# Altium project CCZynq.PrjPCB (part 1 of 4)
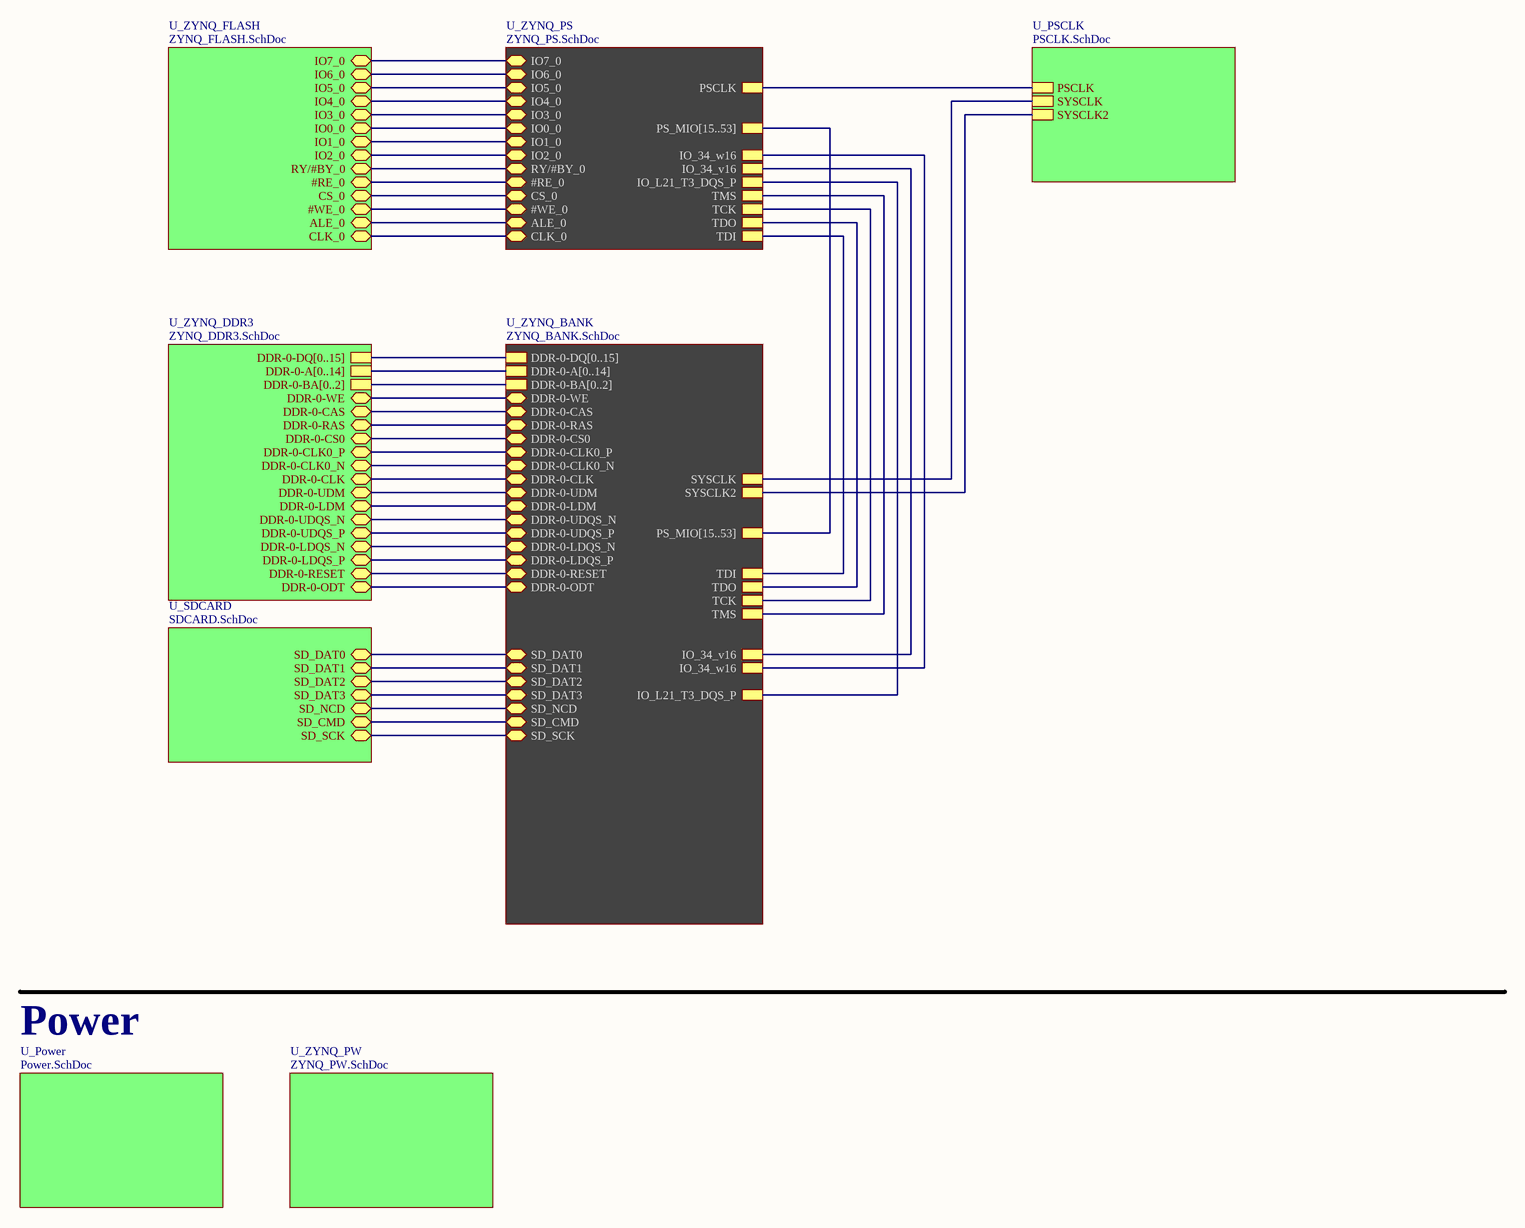
[diagram p0: Diagram.SchDoc]
10 sheets, 213 parts. Net scope: hierarchical (ports join the sheet entries above them; power ports are global).
Board file: DDR3.PcbDoc
Sheets:
  Diagram.SchDoc
    U_ZYNQ_PS = ZYNQ_PS.SchDoc
    U_ZYNQ_BANK = ZYNQ_BANK.SchDoc
    U_ZYNQ_FLASH = ZYNQ_FLASH.SchDoc
    U_ZYNQ_DDR3 = ZYNQ_DDR3.SchDoc
    U_ZYNQ_PW = ZYNQ_PW.SchDoc
    U_Power = Power.SchDoc
      U_Power_DDRTermination = Power_DDRTermination.SchDoc
    U_SDCARD = SDCARD.SchDoc
    U_PSCLK = PSCLK.SchDoc

## Sheet Diagram.SchDoc
size 431 x 279 mm

### Sub-sheets
U_Power = Power.SchDoc: no entries
U_PSCLK = PSCLK.SchDoc: PSCLK, SYSCLK, SYSCLK2
U_SDCARD = SDCARD.SchDoc: SD_DAT0 (bidir), SD_DAT1 (bidir), SD_DAT2 (bidir), SD_DAT3 (bidir), SD_NCD (bidir), SD_CMD (bidir), SD_SCK (bidir)
U_ZYNQ_BANK = ZYNQ_BANK.SchDoc: DDR-0-DQ[0..15], DDR-0-A[0..14], DDR-0-BA[0..2], DDR-0-WE (bidir), DDR-0-CAS (bidir), DDR-0-RAS (bidir), DDR-0-CS0 (bidir), DDR-0-CLK0_P (bidir), DDR-0-CLK0_N (bidir), DDR-0-CLK (bidir), DDR-0-UDM (bidir), DDR-0-LDM (bidir), DDR-0-UDQS_N (bidir), DDR-0-UDQS_P (bidir), DDR-0-LDQS_N (bidir), DDR-0-LDQS_P (bidir), DDR-0-RESET (bidir), DDR-0-ODT (bidir), SD_CMD (bidir), SD_DAT0 (bidir), SD_SCK (bidir), SD_DAT1 (bidir), SD_DAT2 (bidir), SD_DAT3 (bidir), SD_NCD (bidir), SYSCLK, SYSCLK2, PS_MIO[15..53], TDI, TDO, TCK, TMS, IO_34_v16, IO_34_w16, IO_L21_T3_DQS_P
U_ZYNQ_DDR3 = ZYNQ_DDR3.SchDoc: DDR-0-DQ[0..15], DDR-0-A[0..14], DDR-0-BA[0..2], DDR-0-WE (bidir), DDR-0-CAS (bidir), DDR-0-RAS (bidir), DDR-0-CS0 (bidir), DDR-0-CLK0_P (bidir), DDR-0-CLK0_N (bidir), DDR-0-CLK (bidir), DDR-0-UDM (bidir), DDR-0-LDM (bidir), DDR-0-UDQS_N (bidir), DDR-0-UDQS_P (bidir), DDR-0-LDQS_N (bidir), DDR-0-LDQS_P (bidir), DDR-0-RESET (bidir), DDR-0-ODT (bidir)
U_ZYNQ_FLASH = ZYNQ_FLASH.SchDoc: IO7_0 (bidir), IO6_0 (bidir), IO5_0 (bidir), IO4_0 (bidir), IO3_0 (bidir), IO0_0 (bidir), IO1_0 (bidir), IO2_0 (bidir), RY/#BY_0 (bidir), #RE_0 (bidir), CS_0 (bidir), #WE_0 (bidir), ALE_0 (bidir), CLK_0 (bidir)
U_ZYNQ_PS = ZYNQ_PS.SchDoc: IO7_0 (bidir), IO6_0 (bidir), IO5_0 (bidir), IO4_0 (bidir), IO3_0 (bidir), IO0_0 (bidir), IO1_0 (bidir), IO2_0 (bidir), RY/#BY_0 (bidir), #RE_0 (bidir), CS_0 (bidir), #WE_0 (bidir), ALE_0 (bidir), CLK_0 (bidir), PSCLK, PS_MIO[15..53], TDI, TDO, TCK, TMS, IO_34_v16, IO_34_w16, IO_L21_T3_DQS_P
U_ZYNQ_PW = ZYNQ_PW.SchDoc: no entries

### Nets
#RE_0: sheet U_ZYNQ_PS/#RE_0, sheet U_ZYNQ_FLASH/#RE_0
#WE_0: sheet U_ZYNQ_PS/#WE_0, sheet U_ZYNQ_FLASH/#WE_0
ALE_0: sheet U_ZYNQ_PS/ALE_0, sheet U_ZYNQ_FLASH/ALE_0
CLK_0: sheet U_ZYNQ_PS/CLK_0, sheet U_ZYNQ_FLASH/CLK_0
CS_0: sheet U_ZYNQ_PS/CS_0, sheet U_ZYNQ_FLASH/CS_0
DDR-0-CAS: sheet U_ZYNQ_BANK/DDR-0-CAS, sheet U_ZYNQ_DDR3/DDR-0-CAS
DDR-0-CLK: sheet U_ZYNQ_BANK/DDR-0-CLK, sheet U_ZYNQ_DDR3/DDR-0-CLK
DDR-0-CLK0_N: sheet U_ZYNQ_BANK/DDR-0-CLK0_N, sheet U_ZYNQ_DDR3/DDR-0-CLK0_N
DDR-0-CLK0_P: sheet U_ZYNQ_BANK/DDR-0-CLK0_P, sheet U_ZYNQ_DDR3/DDR-0-CLK0_P
DDR-0-CS0: sheet U_ZYNQ_BANK/DDR-0-CS0, sheet U_ZYNQ_DDR3/DDR-0-CS0
DDR-0-LDM: sheet U_ZYNQ_BANK/DDR-0-LDM, sheet U_ZYNQ_DDR3/DDR-0-LDM
DDR-0-LDQS_N: sheet U_ZYNQ_BANK/DDR-0-LDQS_N, sheet U_ZYNQ_DDR3/DDR-0-LDQS_N
DDR-0-LDQS_P: sheet U_ZYNQ_BANK/DDR-0-LDQS_P, sheet U_ZYNQ_DDR3/DDR-0-LDQS_P
DDR-0-ODT: sheet U_ZYNQ_BANK/DDR-0-ODT, sheet U_ZYNQ_DDR3/DDR-0-ODT
DDR-0-RAS: sheet U_ZYNQ_BANK/DDR-0-RAS, sheet U_ZYNQ_DDR3/DDR-0-RAS
DDR-0-RESET: sheet U_ZYNQ_BANK/DDR-0-RESET, sheet U_ZYNQ_DDR3/DDR-0-RESET
DDR-0-UDM: sheet U_ZYNQ_BANK/DDR-0-UDM, sheet U_ZYNQ_DDR3/DDR-0-UDM
DDR-0-UDQS_N: sheet U_ZYNQ_BANK/DDR-0-UDQS_N, sheet U_ZYNQ_DDR3/DDR-0-UDQS_N
DDR-0-UDQS_P: sheet U_ZYNQ_BANK/DDR-0-UDQS_P, sheet U_ZYNQ_DDR3/DDR-0-UDQS_P
DDR-0-WE: sheet U_ZYNQ_BANK/DDR-0-WE, sheet U_ZYNQ_DDR3/DDR-0-WE
IO0_0: sheet U_ZYNQ_PS/IO0_0, sheet U_ZYNQ_FLASH/IO0_0
IO1_0: sheet U_ZYNQ_PS/IO1_0, sheet U_ZYNQ_FLASH/IO1_0
IO2_0: sheet U_ZYNQ_PS/IO2_0, sheet U_ZYNQ_FLASH/IO2_0
IO3_0: sheet U_ZYNQ_PS/IO3_0, sheet U_ZYNQ_FLASH/IO3_0
IO4_0: sheet U_ZYNQ_PS/IO4_0, sheet U_ZYNQ_FLASH/IO4_0
IO5_0: sheet U_ZYNQ_PS/IO5_0, sheet U_ZYNQ_FLASH/IO5_0
IO6_0: sheet U_ZYNQ_PS/IO6_0, sheet U_ZYNQ_FLASH/IO6_0
IO7_0: sheet U_ZYNQ_PS/IO7_0, sheet U_ZYNQ_FLASH/IO7_0
IO_34_v16: sheet U_ZYNQ_PS/IO_34_v16, sheet U_ZYNQ_BANK/IO_34_v16
IO_34_w16: sheet U_ZYNQ_PS/IO_34_w16, sheet U_ZYNQ_BANK/IO_34_w16
IO_L21_T3_DQS_P: sheet U_ZYNQ_PS/IO_L21_T3_DQS_P, sheet U_ZYNQ_BANK/IO_L21_T3_DQS_P
PSCLK: sheet U_ZYNQ_PS/PSCLK, sheet U_PSCLK/PSCLK
RY/#BY_0: sheet U_ZYNQ_PS/RY/#BY_0, sheet U_ZYNQ_FLASH/RY/#BY_0
SD_CMD: sheet U_ZYNQ_BANK/SD_CMD, sheet U_SDCARD/SD_CMD
SD_DAT0: sheet U_ZYNQ_BANK/SD_DAT0, sheet U_SDCARD/SD_DAT0
SD_DAT1: sheet U_ZYNQ_BANK/SD_DAT1, sheet U_SDCARD/SD_DAT1
SD_DAT2: sheet U_ZYNQ_BANK/SD_DAT2, sheet U_SDCARD/SD_DAT2
SD_DAT3: sheet U_ZYNQ_BANK/SD_DAT3, sheet U_SDCARD/SD_DAT3
SD_NCD: sheet U_ZYNQ_BANK/SD_NCD, sheet U_SDCARD/SD_NCD
SD_SCK: sheet U_ZYNQ_BANK/SD_SCK, sheet U_SDCARD/SD_SCK
SYSCLK: sheet U_ZYNQ_BANK/SYSCLK, sheet U_PSCLK/SYSCLK
SYSCLK2: sheet U_ZYNQ_BANK/SYSCLK2, sheet U_PSCLK/SYSCLK2
TCK: sheet U_ZYNQ_PS/TCK, sheet U_ZYNQ_BANK/TCK
TDI: sheet U_ZYNQ_PS/TDI, sheet U_ZYNQ_BANK/TDI
TDO: sheet U_ZYNQ_PS/TDO, sheet U_ZYNQ_BANK/TDO
TMS: sheet U_ZYNQ_PS/TMS, sheet U_ZYNQ_BANK/TMS

### Buses and harness runs
bus sheet U_ZYNQ_BANK/DDR-0-A[0..14] = sheet U_ZYNQ_DDR3/DDR-0-A[0..14]
bus sheet U_ZYNQ_BANK/DDR-0-BA[0..2] = sheet U_ZYNQ_DDR3/DDR-0-BA[0..2]
bus sheet U_ZYNQ_BANK/DDR-0-DQ[0..15] = sheet U_ZYNQ_DDR3/DDR-0-DQ[0..15]
bus sheet U_ZYNQ_BANK/PS_MIO[15..53] = sheet U_ZYNQ_PS/PS_MIO[15..53]

### Notes on the sheet
- Power
- DWG. NO.
- REV.
- SHT.
- THIS DOCUMENT AND THE DATA DISCLOSED HEREIN OR HEREWITH IS THE PROPERTY OF ALTIUM LIMITED AND MAY BE FREELY DISTRIBUTED IN WHOLE. NO RIGHTS ARE RESERVED OR EXPRESS OR IMPLIED WARANTEE GIVEN.
- REVISION
- DESCRIPTION
- DATE
- APPROVED
- ENG:
- APPROVALS
- PROJECT
- DSN:
- CHK:
- REFERENCE DOCUMENTS
- PROJECT REVISION:
- TITLE
- DOCUMENT REVISION:
- DESIGN ITEM:
- BOM:
- FAB DWG:
- PCB DWG:
- ASSY DWG:
- SCALE:
- SIZE
- B
- CAGE CODE
- FILE NAME
- DWG NO.
- SHEET
- OF
- REV

## Sheet ZYNQ_PS.SchDoc
size 431 x 279 mm
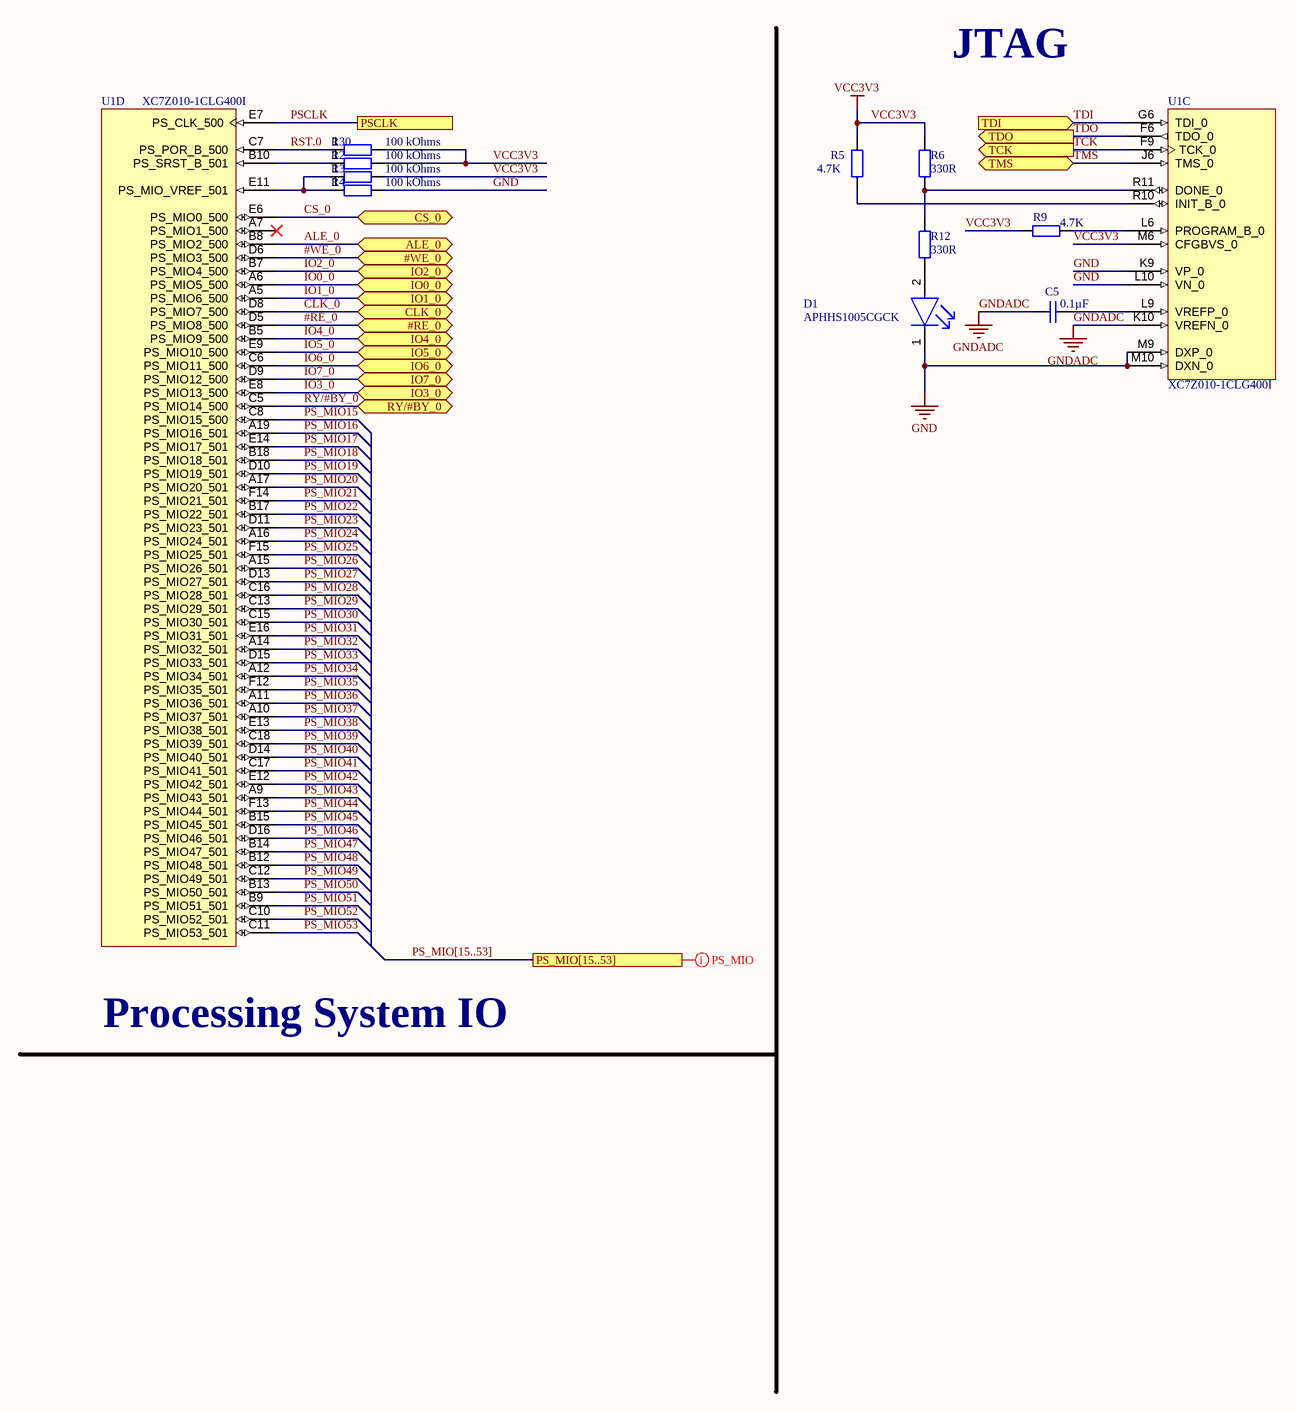
[diagram p1: ZYNQ_PS.SchDoc]

### Parts
C5  0.1µF  [CAP0402i]
D1  APHHS1005CGCK  [FP-APHHS1005CGCK-MFG]
R2  100 kOhms  [RES0402i]
R3  100 kOhms  [RES0402i]
R4  100 kOhms  [RES0402i]
R5  4.7K  [RES0402i]
R6  330R  [RES0402i]
R9  4.7K  [RES0402i]
R12  330R  [RES0402i]
R30  100 kOhms  [RES0402i]
U1  XC7Z010-1CLG400I  [CLG400]  (parts C,D of 9)

### Ports
#RE_0 (bidir), #WE_0 (bidir), ALE_0 (bidir), CLK_0 (bidir), CS_0 (bidir), IO0_0 (bidir), IO1_0 (bidir), IO2_0 (bidir), IO3_0 (bidir), IO4_0 (bidir), IO5_0 (bidir), IO6_0 (bidir), IO7_0 (bidir), PS_MIO[15..53], PSCLK, RY/#BY_0 (bidir), TCK (out), TDI (in), TDO (out), TMS (bidir)

### Nets
GND: D1.1(C) R4.2 U1.K9(VP_0) U1.L10(VN_0) U1.M9(DXP_0) U1.M10(DXN_0)
GNDADC: C5.1 U1.K10(VREFN_0)
VCC3V3: R2.2 R3.2 R5.2 R6.1 R9.1 R30.2 U1.M6(CFGBVS_0)
#RE_0: U1.D5(PS_MIO8_500) ; port #RE_0
#WE_0: U1.D6(PS_MIO3_500) ; port #WE_0
ALE_0: U1.B8(PS_MIO2_500) ; port ALE_0
CLK_0: U1.D8(PS_MIO7_500) ; port CLK_0
CS_0: U1.E6(PS_MIO0_500) ; port CS_0
IO0_0: U1.A6(PS_MIO5_500) ; port IO0_0
IO1_0: U1.A5(PS_MIO6_500) ; port IO1_0
IO2_0: U1.B7(PS_MIO4_500) ; port IO2_0
IO3_0: U1.E8(PS_MIO13_500) ; port IO3_0
IO4_0: U1.B5(PS_MIO9_500) ; port IO4_0
IO5_0: U1.E9(PS_MIO10_500) ; port IO5_0
IO6_0: U1.C6(PS_MIO11_500) ; port IO6_0
IO7_0: U1.D9(PS_MIO12_500) ; port IO7_0
PS_MIO15: U1.C8(PS_MIO15_500)
PS_MIO16: U1.A19(PS_MIO16_501)
PS_MIO17: U1.E14(PS_MIO17_501)
PS_MIO18: U1.B18(PS_MIO18_501)
PS_MIO19: U1.D10(PS_MIO19_501)
PS_MIO20: U1.A17(PS_MIO20_501)
PS_MIO21: U1.F14(PS_MIO21_501)
PS_MIO22: U1.B17(PS_MIO22_501)
PS_MIO23: U1.D11(PS_MIO23_501)
PS_MIO24: U1.A16(PS_MIO24_501)
PS_MIO25: U1.F15(PS_MIO25_501)
PS_MIO26: U1.A15(PS_MIO26_501)
PS_MIO27: U1.D13(PS_MIO27_501)
PS_MIO28: U1.C16(PS_MIO28_501)
PS_MIO29: U1.C13(PS_MIO29_501)
PS_MIO30: U1.C15(PS_MIO30_501)
PS_MIO31: U1.E16(PS_MIO31_501)
PS_MIO32: U1.A14(PS_MIO32_501)
PS_MIO33: U1.D15(PS_MIO33_501)
PS_MIO34: U1.A12(PS_MIO34_501)
PS_MIO35: U1.F12(PS_MIO35_501)
PS_MIO36: U1.A11(PS_MIO36_501)
PS_MIO37: U1.A10(PS_MIO37_501)
PS_MIO38: U1.E13(PS_MIO38_501)
PS_MIO39: U1.C18(PS_MIO39_501)
PS_MIO40: U1.D14(PS_MIO40_501)
PS_MIO41: U1.C17(PS_MIO41_501)
PS_MIO42: U1.E12(PS_MIO42_501)
PS_MIO43: U1.A9(PS_MIO43_501)
PS_MIO44: U1.F13(PS_MIO44_501)
PS_MIO45: U1.B15(PS_MIO45_501)
PS_MIO46: U1.D16(PS_MIO46_501)
PS_MIO47: U1.B14(PS_MIO47_501)
PS_MIO48: U1.B12(PS_MIO48_501)
PS_MIO49: U1.C12(PS_MIO49_501)
PS_MIO50: U1.B13(PS_MIO50_501)
PS_MIO51: U1.B9(PS_MIO51_501)
PS_MIO52: U1.C10(PS_MIO52_501)
PS_MIO53: U1.C11(PS_MIO53_501)
PSCLK: U1.E7(PS_CLK_500) ; port PSCLK
RST.0: R30.1 U1.C7(PS_POR_B_500)
RY/#BY_0: U1.C5(PS_MIO14_500) ; port RY/#BY_0
TCK: U1.F9(TCK_0) ; port TCK
TDI: U1.G6(TDI_0) ; port TDI
TDO: U1.F6(TDO_0) ; port TDO
TMS: U1.J6(TMS_0) ; port TMS
NetC5_2: C5.2 U1.L9(VREFP_0)
NetD1_2: D1.2(A) R12.1
NetR2_1: R2.1 U1.B10(PS_SRST_B_501)
NetR3_1: R3.1 R4.1 U1.E11(PS_MIO_VREF_501)
NetR5_1: R5.1 U1.R10(INIT_B_0)
NetR6_2: R6.2 R12.2 U1.R11(DONE_0)
NetR9_2: R9.2 U1.L6(PROGRAM_B_0)

Not connected (* = marked no-connect by the designer): U1 A7(PS_MIO1_500)*

### Buses and harness runs
bus PS_MIO[15..53] = port PS_MIO[15..53]

### Layout directives
net class PS_MIO; rule Width Constraint [Pref Width = 0.1mm    Min Width = 0.08mm    Max Width = 0.2mm]: (no net found under the mark)

### Notes on the sheet
- JTAG
- Processing System IO
- DWG. NO.
- REV.
- SHT.
- THIS DOCUMENT AND THE DATA DISCLOSED HEREIN OR HEREWITH IS THE PROPERTY OF ALTIUM LIMITED AND MAY BE FREELY DISTRIBUTED IN WHOLE. NO RIGHTS ARE RESERVED OR EXPRESS OR IMPLIED WARANTEE GIVEN.
- REVISION
- DESCRIPTION
- DATE
- APPROVED
- ENG:
- APPROVALS
- PROJECT
- DSN:
- CHK:
- REFERENCE DOCUMENTS
- PROJECT REVISION:
- TITLE
- DOCUMENT REVISION:
- DESIGN ITEM:
- BOM:
- FAB DWG:
- PCB DWG:
- ASSY DWG:
- SCALE:
- SIZE
- B
- CAGE CODE
- FILE NAME
- DWG NO.
- SHEET
- OF
- REV

### Library data of the parts
C5 = Cap_0.1uF_50V_X7R_0402: 0402, 0.1uF, 10%,  50V, X7R; Manufacturer 1: TDK; Manufacturer Part Number 1: C1005X7R1H104K050BE; Type: Ceramic; Value: 0.1µF,50V,X7R; Package: 0402 (1005 Metric); Applications: Automotive; Capacitance: 0.1µF; Component Type: Generic; Mounting Type: SMT; Operating Temperature: -55°C ~ 125°C; Part Number: C1005X7R1H104K050BE; Ratings: AEC-Q200; Supplier 1: Mouser; Supplier 2: DigiKey; Supplier 3: Farnell; Supplier Part Number 1: 810-C1005X7R1H104KBE; Supplier Part Number 2: 445-173610-1-ND; Supplier Part Number 3: 3416071; Temperature Coefficient: X7R; Tolerance: ±10%; Voltage: 50V
D1 = CMP-44529-000044-1: LED GREEN CLEAR CHIP SMD; Viewing Angle: 120°; Dominant Wavelength: 570nm; Test Current: 20mA; Luminous Intensity: 50mcd; Forward Voltage: 2.1V; Number of LEDs: 1; Lens Color: Clear; Packaging: Tape and Reel; Max Operating Temperature: 85°C; Illumination Color: Green; Length: 1mm; Mount: Surface Mount; Lens Style: Clear; Color: Green; Number of Pins: 2; Wavelength: 570nm; Case/Package: 0402; Width: 0.5mm; Package Quantity: 2000; Case Code (Metric): 1005; Height: 0.6mm; Lead Free: Lead Free; Case Code (Imperial): 0402; Forward Current: 20mA; Min Operating Temperature: -40°C
R2-R4 R30 = Res_100K_1%_0402: 0402, 100k, 1%, 62.5mW, 50V; Part Number: CR0402-FX-1003GLF; Manufacturer 1: Bourns; Temperature Coefficient: 100 PPM / C; Package: 0402 (1005 Metric); Voltage: 50 V; Tolerance: ±1%; Operating Temperature: -55°C ~ 125°C; Mounting Type: SMT; Supplier 1: Mouser; Supplier Part Number 1: 652-CR0402FX-1003GLF; Manufacturer Part Number 1: CR0402-FX-1003GLF; Component Type: Generic; Resistance: 100 kOhms; Note: *; Supplier 2: DigiKey; Supplier 3: Farnell; Supplier Part Number 2: CR0402-FX-1003GLFCT-ND; Supplier Part Number 3: 2787798; Value: 100k,1%,62.5mW,50V
R5 R9 = Res_4K7_1%_0402: 0402,4.7K,1%,63mW,50V; Part Number: AC0402FR-074K7L; Manufacturer 1: YAGEO; Alternative Part Number: CR0402-FX-4701GLF; Temperature Coefficient: 100 PPM / C; Value: 4K7,1%,63mW,50V; Package: 0402 (1005 Metric); Voltage: 50V; Tolerance: ±1%; Operating Temperature: -55°C ~ 125°C; Component Type: Generic; Resistance: 4.7K; Note: *; Manufacturer 2: Bourns; Manufacturer Part Number 2: CR0402-FX-4701GLF; Mounting Type: SMT; Manufacturer Part Number 1: AC0402FR-074K7L; Supplier 1: Mouser; Supplier 2: Digi-Key; Supplier 3: Farnell; Supplier 4: Mouser; Supplier 5: Digi-Key; Supplier 6: Farnell; Supplier Part Number 1: 603-AC0402FR-074K7L; Supplier Part Number 2: YAG3497CT-ND; Supplier Part Number 3: 3495205; Supplier Part Number 4: 652-CR0402FX-4701GLF; Supplier Part Number 6: 4014423; Supplier Part Number 5: CR0402-FX-4701GLFCT-ND
R6 R12 = Res_330R_1%_50V_0402: Res Thick Film 0402 330 Ohm 1% 1/16W ±100ppm/°C Molded SMD Paper T/R; Part Number: CRCW0402330RFKED; Manufacturer 1: Vishay; Voltage: 50; Power Rating: 63mW; Voltage Rating: 50V; Value: 330R,1%,1/10W,50V; ComponentLink1Description: https://datasheet.ciiva.com/11821/0900766b80f80784-11821294.pdf?src-supplier=RSComponents; ComponentLink1URL: https://datasheet.ciiva.com/11821/0900766b80f80784-11821294.pdf?src-supplier=RSComponents; Manufacturer Part Number 1: CRCW0402330RFKED; Component Type: Generic; Resistance: 330R; Note: *; ComponentLink2URL: https://datasheet.ciiva.com/7802/aoa0000ce2-7802409.pdf?src-supplier=Element14; ComponentLink2Description: https://datasheet.ciiva.com/7802/aoa0000ce2-7802409.pdf?src-supplier=Element14; ComponentLink3URL: https://datasheet.ciiva.com/22673/1678782-22673685.pdf?src-supplier=Element14; ComponentLink3Description: https://datasheet.ciiva.com/22673/1678782-22673685.pdf?src-supplier=Element14; ComponentLink4URL: https://datasheet.ciiva.com/22687/1678782-22687071.pdf?src-supplier=Element14; ComponentLink4Description: https://datasheet.ciiva.com/22687/1678782-22687071.pdf?src-supplier=Element14; ComponentLink5URL: https://datasheet.ciiva.com/22737/426256-22737285.pdf?src-supplier=Element14; ComponentLink5Description: https://datasheet.ciiva.com/22737/426256-22737285.pdf?src-supplier=Element14; ComponentLink6URL: https://datasheet.ciiva.com/46420/1678782-46420317.pdf?src-supplier=Element14; ComponentLink6Description: https://datasheet.ciiva.com/46420/1678782-46420317.pdf?src-supplier=Element14; ComponentLink7URL: https://datasheet.ciiva.com/24024/aoa0000ce2-24024398.pdf?src-supplier=Mouser; ComponentLink7Description: https://datasheet.ciiva.com/24024/aoa0000ce2-24024398.pdf?src-supplier=Mouser; ComponentLink8URL: https://datasheet.ciiva.com/16784/70260748-16784773.pdf?src-supplier=Allied+Electronics; ComponentLink8Description: https://datasheet.ciiva.com/16784/70260748-16784773.pdf?src-supplier=Allied+Electronics; ComponentLink9URL: https://datasheet.ciiva.com/9190/aoa0000ce2-9190679.pdf?src-supplier=Avnet; ComponentLink9Description: https://datasheet.ciiva.com/9190/aoa0000ce2-9190679.pdf?src-supplier=Avnet; ComponentLink10URL: https://datasheet.ciiva.com/30159/aoa0000ce2-30159014.pdf?src-supplier=Onlinecomponents.com; ComponentLink10Description: https://datasheet.ciiva.com/30159/aoa0000ce2-30159014.pdf?src-supplier=Onlinecomponents.com; Supplier 1: Mouser; Manufacturer: Vishay; Manufacturer Part Number: CRCW0402330RFKED; RoHS: Yes; Category: Chip SMD Resistors; Stock 1: 25067; Pricing 1: 1=0.1, 10=0.042, 50=0.042, 100=0.017, 1000=0.008, 10000=0.005 (USD); Case/Package: 0402; Case Code (Imperial): 0402; Case Code (Metric): 1005; Contact Plating: Tin; Weight: 2.3E-05oz; Min Operating Temperature: -55°C; Max Operating Temperature: 155°C; Packaging: Tape and Reel; Temperature Coefficient: 100ppm/°C; Series: CRCW; Tolerance: 1%; Number of Terminations: 2; Max Power Dissipation: 63mW; Resistor Type: Thick Film; Features: Automotive AEC-Q200; Resistance Tolerance: 1%; Package Quantity: 10; Termination: SMD/SMT; Voltage Rating (DC): 50V; Construction: Rectangular; Technology: THICK FILM; Length: 1mm; Width: 0.02inch; Height: 0.35mm; Depth: 0.5mm; Radiation Hardening: No; RoHS Compliant: Yes; Reach SVHC Compliant: Unknown; Lead Free: Lead Free; Military Standard: Not; ComponentLink11URL: https://datasheet.ciiva.com/11811/0900766b80d98824-11811100.pdf?src-supplier=Rs; ComponentLink11Description: https://datasheet.ciiva.com/11811/0900766b80d98824-11811100.pdf?src-supplier=Rs; ComponentLink12URL: https://datasheet.ciiva.com/7777/1697337-7777541.pdf?src-supplier=Element14; ComponentLink12Description: https://datasheet.ciiva.com/7777/1697337-7777541.pdf?src-supplier=Element14; ComponentLink13URL: https://datasheet.ciiva.com/7777/1697337-7777542.pdf?src-supplier=Element14; ComponentLink13Description: https://datasheet.ciiva.com/7777/1697337-7777542.pdf?src-supplier=Element14; ComponentLink14URL: https://datasheet.ciiva.com/2463/dcrcwe3-2463479.pdf?src-supplier=Digi-Key; ComponentLink14Description: https://datasheet.ciiva.com/2463/dcrcwe3-2463479.pdf?src-supplier=Digi-Key; ComponentLink15URL: https://datasheet.ciiva.com/2463/dcrcwe3-2463480.pdf?src-supplier=Digi-Key; ComponentLink15Description: https://datasheet.ciiva.com/2463/dcrcwe3-2463480.pdf?src-supplier=Digi-Key; ComponentLink16URL: https://datasheet.ciiva.com/2463/dcrcwe3-2463478.pdf?src-supplier=Digi-Key; ComponentLink16Description: https://datasheet.ciiva.com/2463/dcrcwe3-2463478.pdf?src-supplier=Digi-Key; ComponentLink17URL: https://datasheet.ciiva.com/16772/70201119-16772762.pdf?src-supplier=Allied+Electronics; ComponentLink17Description: https://datasheet.ciiva.com/16772/70201119-16772762.pdf?src-supplier=Allied+Electronics; ComponentLink18URL: https://datasheet.ciiva.com/5549/dcrcwe3-109170-5549013.pdf?src-supplier=Mouser; ComponentLink18Description: https://datasheet.ciiva.com/5549/dcrcwe3-109170-5549013.pdf?src-supplier=Mouser; ComponentLink19URL: https://datasheet.ciiva.com/16429/dcrcwe3-16429993.pdf?src-supplier=Future+Electronics; ComponentLink19Description: https://datasheet.ciiva.com/16429/dcrcwe3-16429993.pdf?src-supplier=Future+Electronics; ComponentLink20URL: https://datasheet.ciiva.com/3256/dcrcwe3-3256405.pdf?src-supplier=Avnet; ComponentLink20Description: https://datasheet.ciiva.com/3256/dcrcwe3-3256405.pdf?src-supplier=Avnet; Supplier 2: Digi-Key; Stock 2: 134870; Pricing 2: 1=0.1, 10=0.037, 100=0.0149, 1000=0.00668, 2500=0.0058, 5000=0.00479 (USD); Supplier 3: Farnell; Stock 3: 164855; Pricing 3: 10=0.0395, 100=0.016, 500=0.0075, 2500=0.0066, 5000=0.0056, 10000=0.0047, 50000=0.0046, 100000=0.0045 (EUR); Supplier Part Number 1: 71-CRCW0402-330-E3; Supplier Part Number 2: 541-330LCT-ND; Supplier Part Number 3: 1469709
U1 = XC7Z010-1CLG400I: 667 MHz Zynq?7000 AP SoC, 130 PS I/O, 100 FPGA I/O, 400-Ball BGA, Speed Grade 1, Industrial Grade, Pb-Free; Manufacturer: Xilinx; Extensible Block RAM (# 36Kb Blocks): 240 KB (60); Flip Flops: 35200; LUTs: 17600; Speed Grade: -1; DatasheetVersion: v1.2; PackageVersion: Rev 1.1; PackageReference: CLG400; PackageDescription: Wire-Bond Chip-Scale BGA, Body 17 x 17 mm, 0.8 mm Pitch; Generic Part Number: XC7Z010; RoHS: Pb-Free; Mounting Technology: Surface Mount; Code_JEDEC: MO-275-MMAA-1; PartNumber: XC7Z010-1CLG400I; ComponentLink1Description: Datasheet; ComponentLink1URL: http://www.xilinx.com/support/documentation/data_sheets/ds190-Zynq-7000-Overview.pdf; ComponentLink2Description: Package Specification; ComponentLink2URL: http://www.xilinx.com/support/documentation/user_guides/ug865-Zynq-7000-Pkg-Pinout.pdf; ComponentLink3Description: DC and AC Switching Characteristics; ComponentLink3URL: http://www.xilinx.com/support/documentation/data_sheets/ds187-XC7Z010-XC7Z020-Data-Sheet.pdf; ComponentLink4Description: Package File; ComponentLink4URL: http://www.xilinx.com/support/packagefiles/z7packages/xc7z010clg400pkg.txt; ComponentLink5Description: Packaging and Pinout; ComponentLink5URL: http://www.xilinx.com/support/documentation/user_guides/ug865-Zynq-7000-Pkg-Pinout.pdf; ComponentLink6Description: PCB and Layout Guide; ComponentLink6URL: http://www.xilinx.com/support/documentation/user_guides/ug483_7Series_PCB.pdf

## Sheet ZYNQ_BANK.SchDoc: PL Bank
size 431 x 279 mm
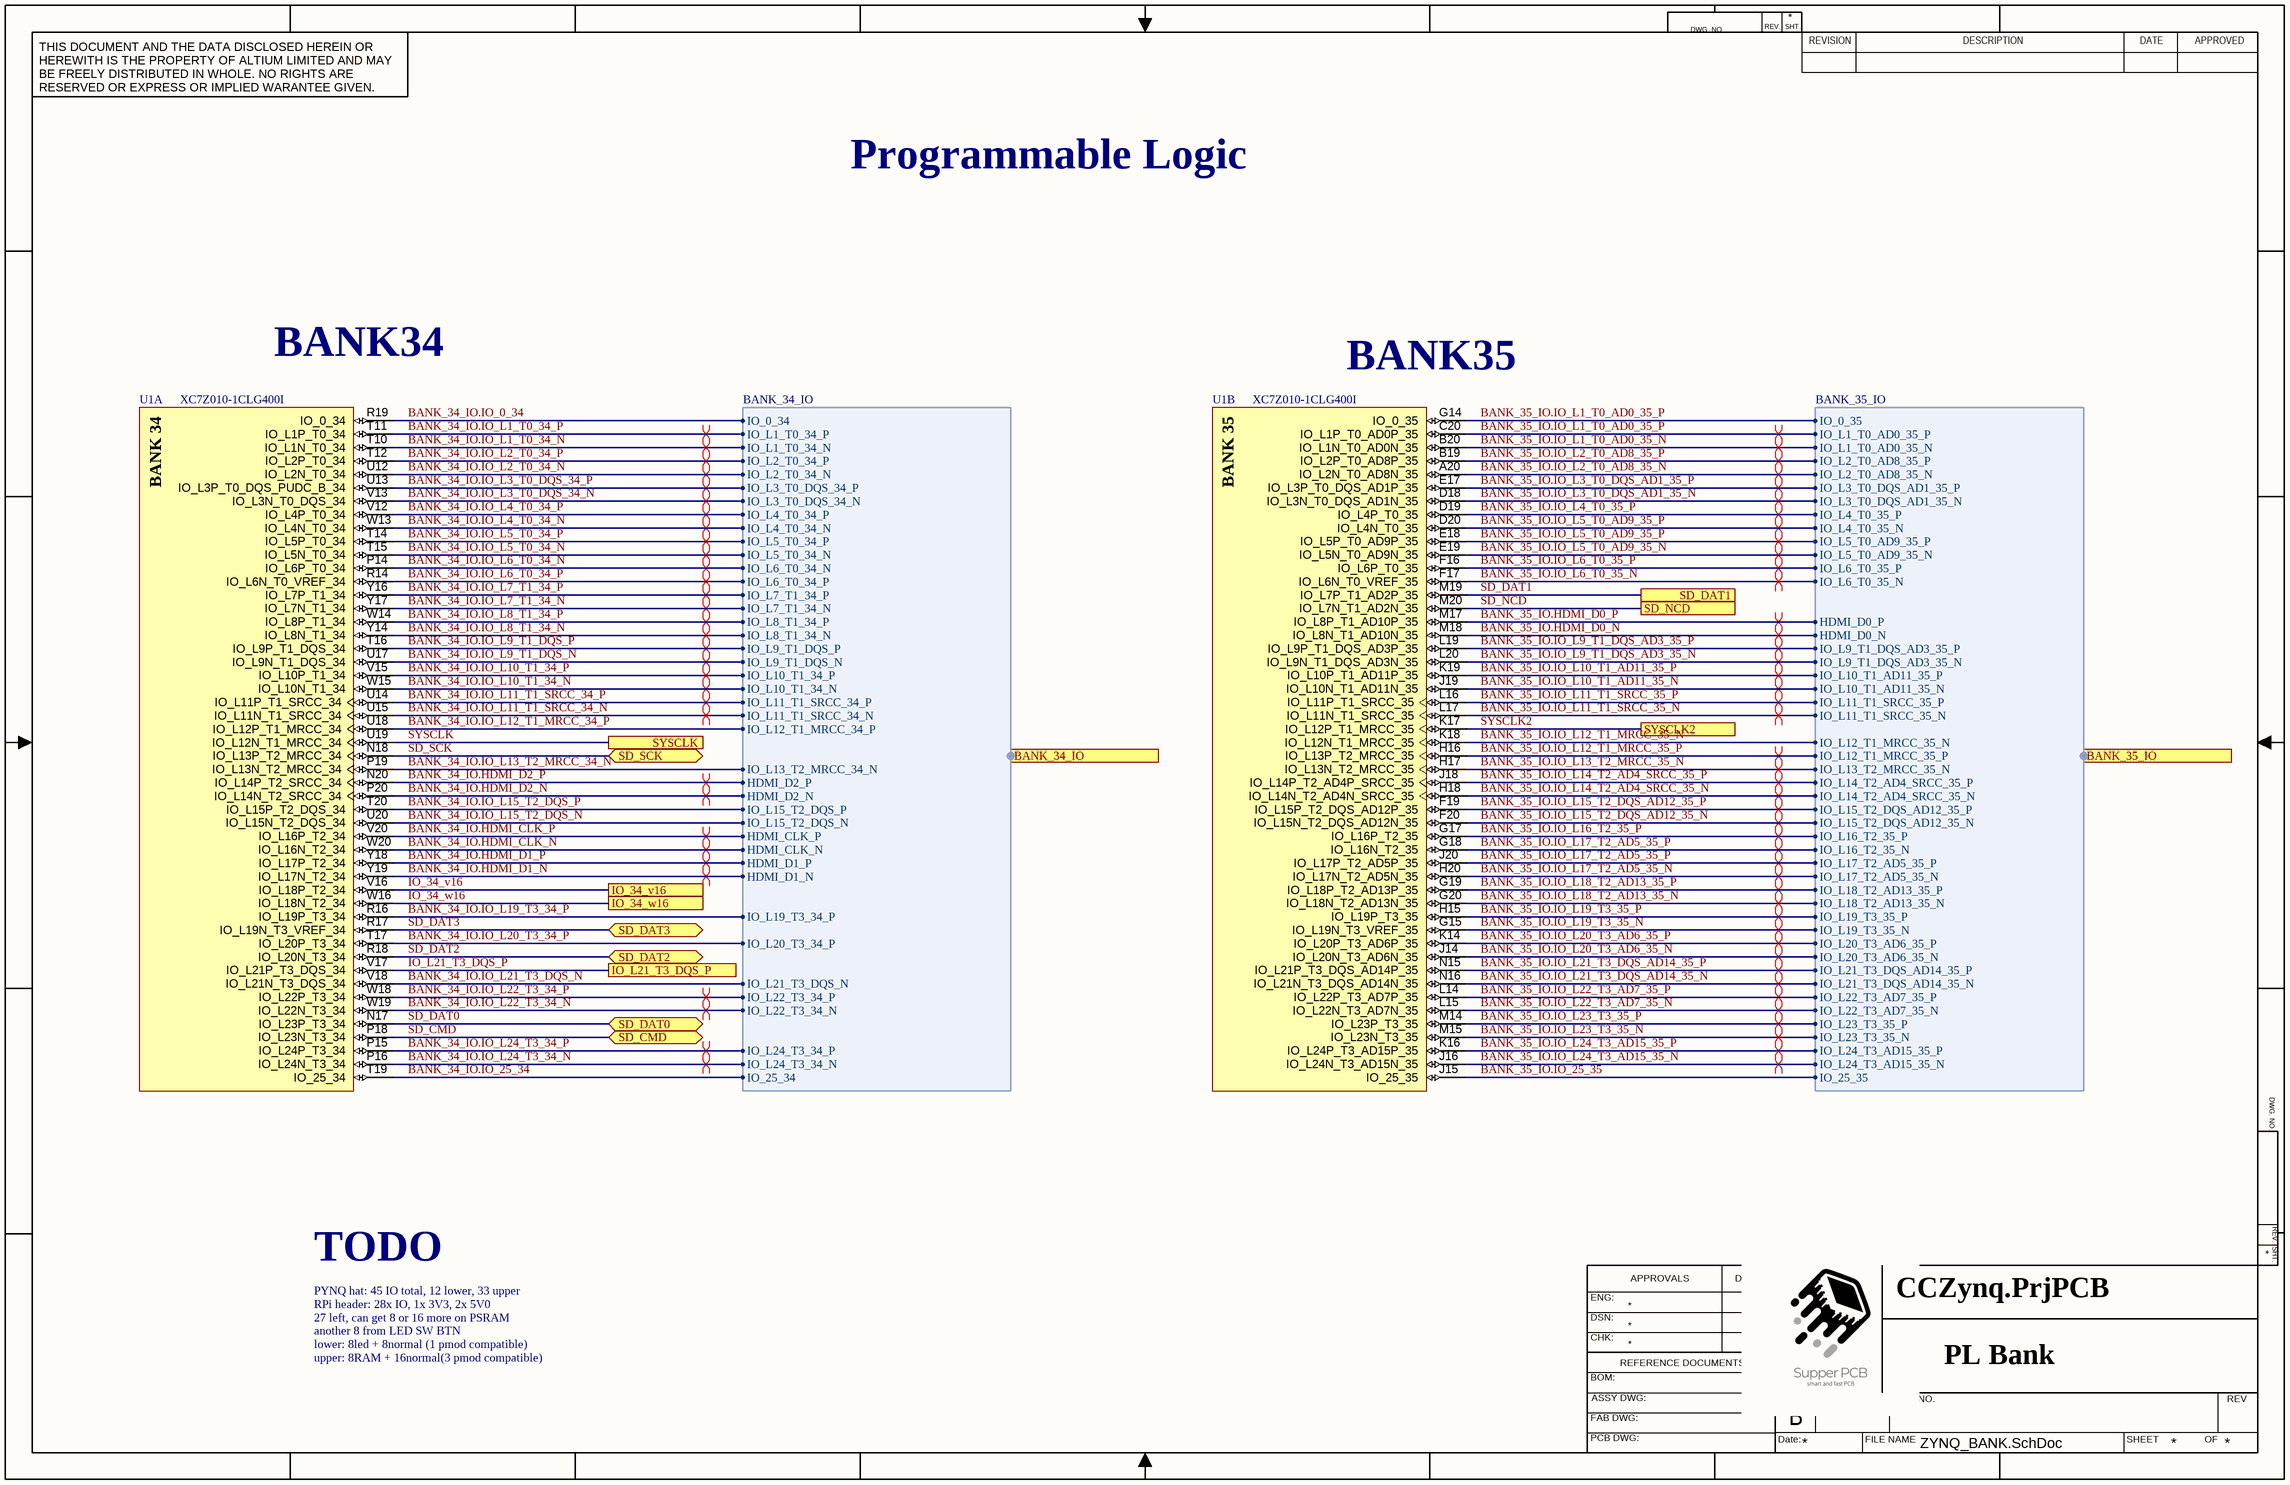
[diagram p2: ZYNQ_BANK.SchDoc]

### Parts
U1  XC7Z010-1CLG400I  [CLG400]  (parts A,B of 9)

### Ports
BANK_34_IO (harness BANK_34_IO), BANK_35_IO (harness BANK_35_IO), IO_34_v16, IO_34_w16, IO_L21_T3_DQS_P, SD_CMD (bidir), SD_DAT0 (bidir), SD_DAT1, SD_DAT2 (bidir), SD_DAT3 (bidir), SD_NCD, SD_SCK (bidir), SYSCLK, SYSCLK2

### Harnesses
BANK_35_IO: IO_0_35, IO_L1_T0_AD0_35_P, IO_L1_T0_AD0_35_N, IO_L2_T0_AD8_35_P, IO_L2_T0_AD8_35_N, IO_L3_T0_DQS_AD1_35_P, IO_L3_T0_DQS_AD1_35_N, IO_L4_T0_35_P, IO_L4_T0_35_N, IO_L5_T0_AD9_35_P, IO_L5_T0_AD9_35_N, IO_L6_T0_35_P, IO_L6_T0_35_N, HDMI_D0_P, HDMI_D0_N, IO_L9_T1_DQS_AD3_35_P, IO_L9_T1_DQS_AD3_35_N, IO_L10_T1_AD11_35_P, IO_L10_T1_AD11_35_N, IO_L11_T1_SRCC_35_P, IO_L11_T1_SRCC_35_N, IO_L12_T1_MRCC_35_N, IO_L12_T1_MRCC_35_P, IO_L13_T2_MRCC_35_N, IO_L14_T2_AD4_SRCC_35_P, IO_L14_T2_AD4_SRCC_35_N, IO_L15_T2_DQS_AD12_35_P, IO_L15_T2_DQS_AD12_35_N, IO_L16_T2_35_P, IO_L16_T2_35_N, IO_L17_T2_AD5_35_P, IO_L17_T2_AD5_35_N, IO_L18_T2_AD13_35_P, IO_L18_T2_AD13_35_N, IO_L19_T3_35_P, IO_L19_T3_35_N, IO_L20_T3_AD6_35_P, IO_L20_T3_AD6_35_N, IO_L21_T3_DQS_AD14_35_P, IO_L21_T3_DQS_AD14_35_N, IO_L22_T3_AD7_35_P, IO_L22_T3_AD7_35_N, IO_L23_T3_35_P, IO_L23_T3_35_N, IO_L24_T3_AD15_35_P, IO_L24_T3_AD15_35_N, IO_25_35
BANK_34_IO: IO_0_34, IO_L1_T0_34_P, IO_L1_T0_34_N, IO_L2_T0_34_P, IO_L2_T0_34_N, IO_L3_T0_DQS_34_P, IO_L3_T0_DQS_34_N, IO_L4_T0_34_P, IO_L4_T0_34_N, IO_L5_T0_34_P, IO_L5_T0_34_N, IO_L6_T0_34_N, IO_L6_T0_34_P, IO_L7_T1_34_P, IO_L7_T1_34_N, IO_L8_T1_34_P, IO_L8_T1_34_N, IO_L9_T1_DQS_P, IO_L9_T1_DQS_N, IO_L10_T1_34_P, IO_L10_T1_34_N, IO_L11_T1_SRCC_34_P, IO_L11_T1_SRCC_34_N, IO_L12_T1_MRCC_34_P, IO_L13_T2_MRCC_34_N, HDMI_D2_P, HDMI_D2_N, IO_L15_T2_DQS_P, IO_L15_T2_DQS_N, HDMI_CLK_P, HDMI_CLK_N, HDMI_D1_P, HDMI_D1_N, IO_L19_T3_34_P, IO_L20_T3_34_P, IO_L21_T3_DQS_N, IO_L22_T3_34_P, IO_L22_T3_34_N, IO_L24_T3_34_P, IO_L24_T3_34_N, IO_25_34

### Nets
BANK_34_IO.HDMI_CLK_N: U1.W20(IO_L16N_T2_34) ; port BANK_34_IO.HDMI_CLK_N
BANK_34_IO.HDMI_CLK_P: U1.V20(IO_L16P_T2_34) ; port BANK_34_IO.HDMI_CLK_P
BANK_34_IO.HDMI_D1_N: U1.Y19(IO_L17N_T2_34) ; port BANK_34_IO.HDMI_D1_N
BANK_34_IO.HDMI_D1_P: U1.Y18(IO_L17P_T2_34) ; port BANK_34_IO.HDMI_D1_P
BANK_34_IO.HDMI_D2_N: U1.P20(IO_L14N_T2_SRCC_34) ; port BANK_34_IO.HDMI_D2_N
BANK_34_IO.HDMI_D2_P: U1.N20(IO_L14P_T2_SRCC_34) ; port BANK_34_IO.HDMI_D2_P
BANK_34_IO.IO_0_34: U1.R19(IO_0_34) ; port BANK_34_IO.IO_0_34
BANK_34_IO.IO_25_34: U1.T19(IO_25_34) ; port BANK_34_IO.IO_25_34
BANK_34_IO.IO_L1_T0_34_N: U1.T10(IO_L1N_T0_34) ; port BANK_34_IO.IO_L1_T0_34_N
BANK_34_IO.IO_L1_T0_34_P: U1.T11(IO_L1P_T0_34) ; port BANK_34_IO.IO_L1_T0_34_P
BANK_34_IO.IO_L2_T0_34_N: U1.U12(IO_L2N_T0_34) ; port BANK_34_IO.IO_L2_T0_34_N
BANK_34_IO.IO_L2_T0_34_P: U1.T12(IO_L2P_T0_34) ; port BANK_34_IO.IO_L2_T0_34_P
BANK_34_IO.IO_L3_T0_DQS_34_N: U1.V13(IO_L3N_T0_DQS_34) ; port BANK_34_IO.IO_L3_T0_DQS_34_N
BANK_34_IO.IO_L3_T0_DQS_34_P: U1.U13(IO_L3P_T0_DQS_PUDC_B_34) ; port BANK_34_IO.IO_L3_T0_DQS_34_P
BANK_34_IO.IO_L4_T0_34_N: U1.W13(IO_L4N_T0_34) ; port BANK_34_IO.IO_L4_T0_34_N
BANK_34_IO.IO_L4_T0_34_P: U1.V12(IO_L4P_T0_34) ; port BANK_34_IO.IO_L4_T0_34_P
BANK_34_IO.IO_L5_T0_34_N: U1.T15(IO_L5N_T0_34) ; port BANK_34_IO.IO_L5_T0_34_N
BANK_34_IO.IO_L5_T0_34_P: U1.T14(IO_L5P_T0_34) ; port BANK_34_IO.IO_L5_T0_34_P
BANK_34_IO.IO_L6_T0_34_N: U1.P14(IO_L6P_T0_34) ; port BANK_34_IO.IO_L6_T0_34_N
BANK_34_IO.IO_L6_T0_34_P: U1.R14(IO_L6N_T0_VREF_34) ; port BANK_34_IO.IO_L6_T0_34_P
BANK_34_IO.IO_L7_T1_34_N: U1.Y17(IO_L7N_T1_34) ; port BANK_34_IO.IO_L7_T1_34_N
BANK_34_IO.IO_L7_T1_34_P: U1.Y16(IO_L7P_T1_34) ; port BANK_34_IO.IO_L7_T1_34_P
BANK_34_IO.IO_L8_T1_34_N: U1.Y14(IO_L8N_T1_34) ; port BANK_34_IO.IO_L8_T1_34_N
BANK_34_IO.IO_L8_T1_34_P: U1.W14(IO_L8P_T1_34) ; port BANK_34_IO.IO_L8_T1_34_P
BANK_34_IO.IO_L9_T1_DQS_N: U1.U17(IO_L9N_T1_DQS_34) ; port BANK_34_IO.IO_L9_T1_DQS_N
BANK_34_IO.IO_L9_T1_DQS_P: U1.T16(IO_L9P_T1_DQS_34) ; port BANK_34_IO.IO_L9_T1_DQS_P
BANK_34_IO.IO_L10_T1_34_N: U1.W15(IO_L10N_T1_34) ; port BANK_34_IO.IO_L10_T1_34_N
BANK_34_IO.IO_L10_T1_34_P: U1.V15(IO_L10P_T1_34) ; port BANK_34_IO.IO_L10_T1_34_P
BANK_34_IO.IO_L11_T1_SRCC_34_N: U1.U15(IO_L11N_T1_SRCC_34) ; port BANK_34_IO.IO_L11_T1_SRCC_34_N
BANK_34_IO.IO_L11_T1_SRCC_34_P: U1.U14(IO_L11P_T1_SRCC_34) ; port BANK_34_IO.IO_L11_T1_SRCC_34_P
BANK_34_IO.IO_L12_T1_MRCC_34_P: U1.U18(IO_L12P_T1_MRCC_34) ; port BANK_34_IO.IO_L12_T1_MRCC_34_P
BANK_34_IO.IO_L13_T2_MRCC_34_N: U1.P19(IO_L13N_T2_MRCC_34) ; port BANK_34_IO.IO_L13_T2_MRCC_34_N
BANK_34_IO.IO_L15_T2_DQS_N: U1.U20(IO_L15N_T2_DQS_34) ; port BANK_34_IO.IO_L15_T2_DQS_N
BANK_34_IO.IO_L15_T2_DQS_P: U1.T20(IO_L15P_T2_DQS_34) ; port BANK_34_IO.IO_L15_T2_DQS_P
BANK_34_IO.IO_L19_T3_34_P: U1.R16(IO_L19P_T3_34) ; port BANK_34_IO.IO_L19_T3_34_P
BANK_34_IO.IO_L20_T3_34_P: U1.T17(IO_L20P_T3_34) ; port BANK_34_IO.IO_L20_T3_34_P
BANK_34_IO.IO_L21_T3_DQS_N: U1.V18(IO_L21N_T3_DQS_34) ; port BANK_34_IO.IO_L21_T3_DQS_N
BANK_34_IO.IO_L22_T3_34_N: U1.W19(IO_L22N_T3_34) ; port BANK_34_IO.IO_L22_T3_34_N
BANK_34_IO.IO_L22_T3_34_P: U1.W18(IO_L22P_T3_34) ; port BANK_34_IO.IO_L22_T3_34_P
BANK_34_IO.IO_L24_T3_34_N: U1.P16(IO_L24N_T3_34) ; port BANK_34_IO.IO_L24_T3_34_N
BANK_34_IO.IO_L24_T3_34_P: U1.P15(IO_L24P_T3_34) ; port BANK_34_IO.IO_L24_T3_34_P
BANK_35_IO.HDMI_D0_N: U1.M18(IO_L8N_T1_AD10N_35) ; port BANK_35_IO.HDMI_D0_N
BANK_35_IO.HDMI_D0_P: U1.M17(IO_L8P_T1_AD10P_35) ; port BANK_35_IO.HDMI_D0_P
BANK_35_IO.IO_25_35: U1.J15(IO_25_35) ; port BANK_35_IO.IO_25_35
BANK_35_IO.IO_L1_T0_AD0_35_N: U1.B20(IO_L1N_T0_AD0N_35) ; port BANK_35_IO.IO_L1_T0_AD0_35_N
BANK_35_IO.IO_L1_T0_AD0_35_P: U1.C20(IO_L1P_T0_AD0P_35) U1.G14(IO_0_35) ; port BANK_35_IO.IO_0_35, port BANK_35_IO.IO_L1_T0_AD0_35_P
BANK_35_IO.IO_L2_T0_AD8_35_N: U1.A20(IO_L2N_T0_AD8N_35) ; port BANK_35_IO.IO_L2_T0_AD8_35_N
BANK_35_IO.IO_L2_T0_AD8_35_P: U1.B19(IO_L2P_T0_AD8P_35) ; port BANK_35_IO.IO_L2_T0_AD8_35_P
BANK_35_IO.IO_L3_T0_DQS_AD1_35_N: U1.D18(IO_L3N_T0_DQS_AD1N_35) ; port BANK_35_IO.IO_L3_T0_DQS_AD1_35_N
BANK_35_IO.IO_L3_T0_DQS_AD1_35_P: U1.E17(IO_L3P_T0_DQS_AD1P_35) ; port BANK_35_IO.IO_L3_T0_DQS_AD1_35_P
BANK_35_IO.IO_L4_T0_35_P: U1.D19(IO_L4P_T0_35) ; port BANK_35_IO.IO_L4_T0_35_P
BANK_35_IO.IO_L5_T0_AD9_35_N: U1.E19(IO_L5N_T0_AD9N_35) ; port BANK_35_IO.IO_L5_T0_AD9_35_N
BANK_35_IO.IO_L5_T0_AD9_35_P: U1.D20(IO_L4N_T0_35) U1.E18(IO_L5P_T0_AD9P_35) ; port BANK_35_IO.IO_L4_T0_35_N, port BANK_35_IO.IO_L5_T0_AD9_35_P
BANK_35_IO.IO_L6_T0_35_N: U1.F17(IO_L6N_T0_VREF_35) ; port BANK_35_IO.IO_L6_T0_35_N
BANK_35_IO.IO_L6_T0_35_P: U1.F16(IO_L6P_T0_35) ; port BANK_35_IO.IO_L6_T0_35_P
BANK_35_IO.IO_L9_T1_DQS_AD3_35_N: U1.L20(IO_L9N_T1_DQS_AD3N_35) ; port BANK_35_IO.IO_L9_T1_DQS_AD3_35_N
BANK_35_IO.IO_L9_T1_DQS_AD3_35_P: U1.L19(IO_L9P_T1_DQS_AD3P_35) ; port BANK_35_IO.IO_L9_T1_DQS_AD3_35_P
BANK_35_IO.IO_L10_T1_AD11_35_N: U1.J19(IO_L10N_T1_AD11N_35) ; port BANK_35_IO.IO_L10_T1_AD11_35_N
BANK_35_IO.IO_L10_T1_AD11_35_P: U1.K19(IO_L10P_T1_AD11P_35) ; port BANK_35_IO.IO_L10_T1_AD11_35_P
BANK_35_IO.IO_L11_T1_SRCC_35_N: U1.L17(IO_L11N_T1_SRCC_35) ; port BANK_35_IO.IO_L11_T1_SRCC_35_N
BANK_35_IO.IO_L11_T1_SRCC_35_P: U1.L16(IO_L11P_T1_SRCC_35) ; port BANK_35_IO.IO_L11_T1_SRCC_35_P
BANK_35_IO.IO_L12_T1_MRCC_35_N: U1.K18(IO_L12N_T1_MRCC_35) ; port BANK_35_IO.IO_L12_T1_MRCC_35_N
BANK_35_IO.IO_L12_T1_MRCC_35_P: U1.H16(IO_L13P_T2_MRCC_35) ; port BANK_35_IO.IO_L12_T1_MRCC_35_P
BANK_35_IO.IO_L13_T2_MRCC_35_N: U1.H17(IO_L13N_T2_MRCC_35) ; port BANK_35_IO.IO_L13_T2_MRCC_35_N
BANK_35_IO.IO_L14_T2_AD4_SRCC_35_N: U1.H18(IO_L14N_T2_AD4N_SRCC_35) ; port BANK_35_IO.IO_L14_T2_AD4_SRCC_35_N
BANK_35_IO.IO_L14_T2_AD4_SRCC_35_P: U1.J18(IO_L14P_T2_AD4P_SRCC_35) ; port BANK_35_IO.IO_L14_T2_AD4_SRCC_35_P
BANK_35_IO.IO_L15_T2_DQS_AD12_35_N: U1.F20(IO_L15N_T2_DQS_AD12N_35) ; port BANK_35_IO.IO_L15_T2_DQS_AD12_35_N
BANK_35_IO.IO_L15_T2_DQS_AD12_35_P: U1.F19(IO_L15P_T2_DQS_AD12P_35) ; port BANK_35_IO.IO_L15_T2_DQS_AD12_35_P
BANK_35_IO.IO_L16_T2_35_P: U1.G17(IO_L16P_T2_35) ; port BANK_35_IO.IO_L16_T2_35_P
BANK_35_IO.IO_L17_T2_AD5_35_N: U1.H20(IO_L17N_T2_AD5N_35) ; port BANK_35_IO.IO_L17_T2_AD5_35_N
BANK_35_IO.IO_L17_T2_AD5_35_P: U1.G18(IO_L16N_T2_35) U1.J20(IO_L17P_T2_AD5P_35) ; port BANK_35_IO.IO_L16_T2_35_N, port BANK_35_IO.IO_L17_T2_AD5_35_P
BANK_35_IO.IO_L18_T2_AD13_35_N: U1.G20(IO_L18N_T2_AD13N_35) ; port BANK_35_IO.IO_L18_T2_AD13_35_N
BANK_35_IO.IO_L18_T2_AD13_35_P: U1.G19(IO_L18P_T2_AD13P_35) ; port BANK_35_IO.IO_L18_T2_AD13_35_P
BANK_35_IO.IO_L19_T3_35_N: U1.G15(IO_L19N_T3_VREF_35) ; port BANK_35_IO.IO_L19_T3_35_N
BANK_35_IO.IO_L19_T3_35_P: U1.H15(IO_L19P_T3_35) ; port BANK_35_IO.IO_L19_T3_35_P
BANK_35_IO.IO_L20_T3_AD6_35_N: U1.J14(IO_L20N_T3_AD6N_35) ; port BANK_35_IO.IO_L20_T3_AD6_35_N
BANK_35_IO.IO_L20_T3_AD6_35_P: U1.K14(IO_L20P_T3_AD6P_35) ; port BANK_35_IO.IO_L20_T3_AD6_35_P
BANK_35_IO.IO_L21_T3_DQS_AD14_35_N: U1.N16(IO_L21N_T3_DQS_AD14N_35) ; port BANK_35_IO.IO_L21_T3_DQS_AD14_35_N
BANK_35_IO.IO_L21_T3_DQS_AD14_35_P: U1.N15(IO_L21P_T3_DQS_AD14P_35) ; port BANK_35_IO.IO_L21_T3_DQS_AD14_35_P
BANK_35_IO.IO_L22_T3_AD7_35_N: U1.L15(IO_L22N_T3_AD7N_35) ; port BANK_35_IO.IO_L22_T3_AD7_35_N
BANK_35_IO.IO_L22_T3_AD7_35_P: U1.L14(IO_L22P_T3_AD7P_35) ; port BANK_35_IO.IO_L22_T3_AD7_35_P
BANK_35_IO.IO_L23_T3_35_N: U1.M15(IO_L23N_T3_35) ; port BANK_35_IO.IO_L23_T3_35_N
BANK_35_IO.IO_L23_T3_35_P: U1.M14(IO_L23P_T3_35) ; port BANK_35_IO.IO_L23_T3_35_P
BANK_35_IO.IO_L24_T3_AD15_35_N: U1.J16(IO_L24N_T3_AD15N_35) ; port BANK_35_IO.IO_L24_T3_AD15_35_N
BANK_35_IO.IO_L24_T3_AD15_35_P: U1.K16(IO_L24P_T3_AD15P_35) ; port BANK_35_IO.IO_L24_T3_AD15_35_P
IO_34_v16: U1.V16(IO_L18P_T2_34) ; port IO_34_v16
IO_34_w16: U1.W16(IO_L18N_T2_34) ; port IO_34_w16
IO_L21_T3_DQS_P: U1.V17(IO_L21P_T3_DQS_34) ; port IO_L21_T3_DQS_P
SD_CMD: U1.P18(IO_L23N_T3_34) ; port SD_CMD
SD_DAT0: U1.N17(IO_L23P_T3_34) ; port SD_DAT0
SD_DAT1: U1.M19(IO_L7P_T1_AD2P_35) ; port SD_DAT1
SD_DAT2: U1.R18(IO_L20N_T3_34) ; port SD_DAT2
SD_DAT3: U1.R17(IO_L19N_T3_VREF_34) ; port SD_DAT3
SD_NCD: U1.M20(IO_L7N_T1_AD2N_35) ; port SD_NCD
SD_SCK: U1.N18(IO_L13P_T2_MRCC_34) ; port SD_SCK
SYSCLK: U1.U19(IO_L12N_T1_MRCC_34) ; port SYSCLK
SYSCLK2: U1.K17(IO_L12P_T1_MRCC_35) ; port SYSCLK2

### Layout directives
differential pair: BANK_34_IO.HDMI_CLK_N, BANK_34_IO.HDMI_CLK_P, BANK_34_IO.HDMI_D1_N, BANK_34_IO.HDMI_D1_P, BANK_34_IO.HDMI_D2_N, BANK_34_IO.HDMI_D2_P, BANK_34_IO.IO_L1_T0_34_N, BANK_34_IO.IO_L1_T0_34_P, BANK_34_IO.IO_L2_T0_34_N, BANK_34_IO.IO_L2_T0_34_P, BANK_34_IO.IO_L3_T0_DQS_34_N, BANK_34_IO.IO_L3_T0_DQS_34_P, BANK_34_IO.IO_L4_T0_34_N, BANK_34_IO.IO_L4_T0_34_P, BANK_34_IO.IO_L5_T0_34_N, BANK_34_IO.IO_L5_T0_34_P, BANK_34_IO.IO_L6_T0_34_N, BANK_34_IO.IO_L6_T0_34_P, BANK_34_IO.IO_L7_T1_34_N, BANK_34_IO.IO_L7_T1_34_P, BANK_34_IO.IO_L8_T1_34_N, BANK_34_IO.IO_L8_T1_34_P, BANK_34_IO.IO_L9_T1_DQS_N, BANK_34_IO.IO_L9_T1_DQS_P, BANK_34_IO.IO_L10_T1_34_N, BANK_34_IO.IO_L10_T1_34_P, BANK_34_IO.IO_L11_T1_SRCC_34_N, BANK_34_IO.IO_L11_T1_SRCC_34_P, BANK_34_IO.IO_L22_T3_34_N, BANK_34_IO.IO_L22_T3_34_P, BANK_34_IO.IO_L24_T3_34_N, BANK_34_IO.IO_L24_T3_34_P, BANK_35_IO.HDMI_D0_N, BANK_35_IO.HDMI_D0_P, BANK_35_IO.IO_L1_T0_AD0_35_N, BANK_35_IO.IO_L1_T0_AD0_35_P, BANK_35_IO.IO_L2_T0_AD8_35_N, BANK_35_IO.IO_L2_T0_AD8_35_P, BANK_35_IO.IO_L3_T0_DQS_AD1_35_N, BANK_35_IO.IO_L3_T0_DQS_AD1_35_P, BANK_35_IO.IO_L4_T0_35_P, BANK_35_IO.IO_L5_T0_AD9_35_N, BANK_35_IO.IO_L5_T0_AD9_35_P, BANK_35_IO.IO_L6_T0_35_N, BANK_35_IO.IO_L6_T0_35_P, BANK_35_IO.IO_L9_T1_DQS_AD3_35_N, BANK_35_IO.IO_L9_T1_DQS_AD3_35_P, BANK_35_IO.IO_L10_T1_AD11_35_N, BANK_35_IO.IO_L10_T1_AD11_35_P, BANK_35_IO.IO_L11_T1_SRCC_35_N, BANK_35_IO.IO_L11_T1_SRCC_35_P, BANK_35_IO.IO_L12_T1_MRCC_35_P, BANK_35_IO.IO_L13_T2_MRCC_35_N, BANK_35_IO.IO_L14_T2_AD4_SRCC_35_N, BANK_35_IO.IO_L14_T2_AD4_SRCC_35_P, BANK_35_IO.IO_L15_T2_DQS_AD12_35_N, BANK_35_IO.IO_L15_T2_DQS_AD12_35_P, BANK_35_IO.IO_L16_T2_35_P, BANK_35_IO.IO_L17_T2_AD5_35_N, BANK_35_IO.IO_L17_T2_AD5_35_P, BANK_35_IO.IO_L18_T2_AD13_35_N, BANK_35_IO.IO_L18_T2_AD13_35_P, BANK_35_IO.IO_L19_T3_35_N, BANK_35_IO.IO_L19_T3_35_P, BANK_35_IO.IO_L20_T3_AD6_35_N, BANK_35_IO.IO_L20_T3_AD6_35_P, BANK_35_IO.IO_L21_T3_DQS_AD14_35_N, BANK_35_IO.IO_L21_T3_DQS_AD14_35_P, BANK_35_IO.IO_L22_T3_AD7_35_N, BANK_35_IO.IO_L22_T3_AD7_35_P, BANK_35_IO.IO_L23_T3_35_N, BANK_35_IO.IO_L23_T3_35_P, BANK_35_IO.IO_L24_T3_AD15_35_N, BANK_35_IO.IO_L24_T3_AD15_35_P

### Notes on the sheet
- Programmable Logic
- BANK34
- (near U1) BANK35
- PYNQ hat: 45 IO total, 12 lower, 33 upper
- TODO
- 27 left, can get 8 or 16 more on PSRAM
- another 8 from LED SW BTN
- lower: 8led + 8normal (1 pmod compatible)
- upper: 8RAM + 16normal(3 pmod compatible)
- RPi header: 28x IO, 1x 3V3, 2x 5V0
- DWG. NO.
- REV.
- SHT.
- THIS DOCUMENT AND THE DATA DISCLOSED HEREIN OR HEREWITH IS THE PROPERTY OF ALTIUM LIMITED AND MAY BE FREELY DISTRIBUTED IN WHOLE. NO RIGHTS ARE RESERVED OR EXPRESS OR IMPLIED WARANTEE GIVEN.
- REVISION
- DESCRIPTION
- DATE
- APPROVED
- ENG:
- APPROVALS
- DSN:
- CHK:
- REFERENCE DOCUMENTS
- BOM:
- FAB DWG:
- PCB DWG:
- ASSY DWG:
- Date:
- SIZE
- B
- Ver:
- FILE NAME
- DWG NO.
- SHEET
- OF
- REV
- (in symbol XC7Z010-1CLG400I, part A) BANK 34
- (in symbol XC7Z010-1CLG400I, part B) BANK 35

### Library data of the parts
U1 = XC7Z010-1CLG400I: as U1 on sheet ZYNQ_PS; DatasheetVersion: v1.2; PackageVersion: Rev 1.1; PackageReference: CLG400; PackageDescription: Wire-Bond Chip-Scale BGA, Body 17 x 17 mm, 0.8 mm Pitch; Generic Part Number: XC7Z010; RoHS: Pb-Free; Mounting Technology: Surface Mount; Code_JEDEC: MO-275-MMAA-1; PartNumber: XC7Z010-1CLG400I; ComponentLink1Description: Datasheet; ComponentLink1URL: http://www.xilinx.com/support/documentation/data_sheets/ds190-Zynq-7000-Overview.pdf; ComponentLink2Description: Package Specification; ComponentLink2URL: http://www.xilinx.com/support/documentation/user_guides/ug865-Zynq-7000-Pkg-Pinout.pdf; ComponentLink3Description: DC and AC Switching Characteristics; ComponentLink3URL: http://www.xilinx.com/support/documentation/data_sheets/ds187-XC7Z010-XC7Z020-Data-Sheet.pdf; ComponentLink4Description: Package File; ComponentLink4URL: http://www.xilinx.com/support/packagefiles/z7packages/xc7z010clg400pkg.txt; ComponentLink5Description: Packaging and Pinout; ComponentLink5URL: http://www.xilinx.com/support/documentation/user_guides/ug865-Zynq-7000-Pkg-Pinout.pdf; ComponentLink6Description: PCB and Layout Guide; ComponentLink6URL: http://www.xilinx.com/support/documentation/user_guides/ug483_7Series_PCB.pdf

## Sheet ZYNQ_FLASH.SchDoc
size 431 x 279 mm
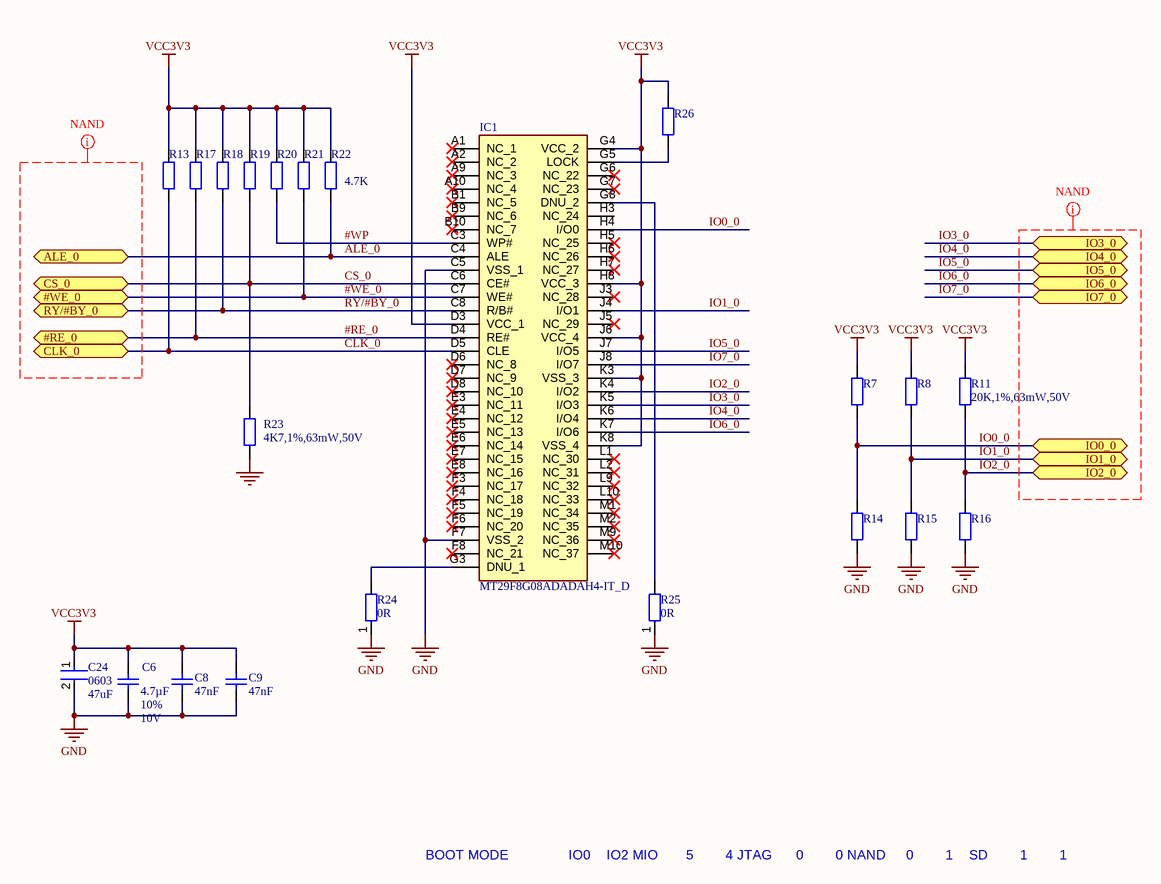
[diagram p3: ZYNQ_FLASH.SchDoc]

### Parts
C6  Tolerance: 10%  Voltage Rating: 10V  [CAP0402i]  (hidden comment: 4.7µF)
C8  Capacitance: 47nF  [CAP0201i]
C9  Capacitance: 47nF  [CAP0201i]
C24  Case Code (Imperial): 0603  Capacitance: 47uF  [FP-GRM188-0_2-IPC_B]  (hidden comment: GRM188R60J476ME15D)
IC1  MT29F8G08ADADAH4-IT_D  [BGA63C80P10X12_900X1100X100]
R7  20kOhm  [RES0402i]  (value not drawn)
R8  20kOhm  [RES0402i]  (value not drawn)
R11  value 20K,1%,63mW,50V  [RES0402i]  (hidden comment: 20kOhm)
R13  4.7K  [RES0402i]  (value not drawn)
R14  20kOhm  [RES0402i]  (value not drawn)
R15  20kOhm  [RES0402i]  (value not drawn)
R16  20kOhm  [RES0402i]  (value not drawn)
R17  4.7K  [RES0402i]  (value not drawn)
R18  4.7K  [RES0402i]  (value not drawn)
R19  4.7K  [RES0402i]  (value not drawn)
R20  4.7K  [RES0402i]  (value not drawn)
R21  4.7K  [RES0402i]  (value not drawn)
R22  4.7K  [RES0402i]
R23  value 4K7,1%,63mW,50V  [RES0402i]  (hidden comment: 4.7K)
R24  value 0R  [RES0402i]  (hidden comment: 0 Ohms)
R25  value 0R  [RES0402i]  (hidden comment: 0 Ohms)
R26  20kOhm  [RES0402i]  (value not drawn)

### Ports
#RE_0 (bidir), #WE_0 (bidir), ALE_0 (bidir), CLK_0 (bidir), CS_0 (bidir), IO0_0 (bidir), IO1_0 (bidir), IO2_0 (bidir), IO3_0 (bidir), IO4_0 (bidir), IO5_0 (bidir), IO6_0 (bidir), IO7_0 (bidir), RY/#BY_0 (bidir)

### Nets
GND: C6.1 C8.1 C9.1 C24.2 IC1.C5(VSS_1) IC1.F7(VSS_2) R14.1 R15.1 R16.1 R23.1 R24.1 R25.1
VCC3V3: C6.2 C8.2 C9.2 C24.1 IC1.D3(VCC_1) IC1.G4(VCC_2) IC1.H8(VCC_3) IC1.J6(VCC_4) IC1.K3(VSS_3) IC1.K8(VSS_4) R7.2 R8.2 R11.2 R13.2 R17.2 R18.2 R19.2 R20.2 R21.2 R22.2 R26.2
#RE_0: IC1.D4(RE#) R17.1 ; port #RE_0
#WE_0: IC1.C7(WE#) R21.1 ; port #WE_0
#WP: IC1.C3(WP#) R20.1
ALE_0: IC1.C4(ALE) R22.1 ; port ALE_0
CLK_0: IC1.D5(CLE) R13.1 ; port CLK_0
CS_0: IC1.C6(CE#) R19.1 R23.2 ; port CS_0
IO0_0: IC1.H4(I/O0) R7.1 R14.2 ; port IO0_0
IO1_0: IC1.J4(I/O1) R8.1 R15.2 ; port IO1_0
IO2_0: IC1.K4(I/O2) R11.1 R16.2 ; port IO2_0
IO3_0: IC1.K5(I/O3) ; port IO3_0
IO4_0: IC1.K6(I/O4) ; port IO4_0
IO5_0: IC1.J7(I/O5) ; port IO5_0
IO6_0: IC1.K7(I/O6) ; port IO6_0
IO7_0: IC1.J8(I/O7) ; port IO7_0
RY/#BY_0: IC1.C8(R/B#) R18.1 ; port RY/#BY_0
NetIC1_G3: IC1.G3(DNU_1) R24.2
NetIC1_G5: IC1.G5(LOCK) R26.1
NetIC1_G8: IC1.G8(DNU_2) R25.2

Not connected (* = marked no-connect by the designer): IC1 A1(NC_1)* A2(NC_2)* A9(NC_3)* A10(NC_4)* B1(NC_5)* B9(NC_6)* B10(NC_7)* D6(NC_8)* D7(NC_9)* D8(NC_10)* E3(NC_11)* E4(NC_12)* E5(NC_13)* E6(NC_14)* E7(NC_15)* E8(NC_16)* F3(NC_17)* F4(NC_18)* F5(NC_19)* F6(NC_20)* F8(NC_21)* G6(NC_22)* G7(NC_23)* H3(NC_24) H5(NC_25)* H6(NC_26)* H7(NC_27)* J3(NC_28)* J5(NC_29)* L1(NC_30)* L2(NC_31)* L9(NC_32)* L10(NC_33)* M1(NC_34)* M2(NC_35)* M9(NC_36)* M10(NC_37)*

### Layout directives
net class NAND: (no net found under the mark)

### Notes on the sheet
- BOOT MODE
  IO0    IO2
  MIO       5        4
  JTAG      0        0
  NAND     0        1
  SD        1        1
- DWG. NO.
- REV.
- SHT.
- THIS DOCUMENT AND THE DATA DISCLOSED HEREIN OR HEREWITH IS THE PROPERTY OF ALTIUM LIMITED AND MAY BE FREELY DISTRIBUTED IN WHOLE. NO RIGHTS ARE RESERVED OR EXPRESS OR IMPLIED WARANTEE GIVEN.
- REVISION
- DESCRIPTION
- DATE
- APPROVED
- ENG:
- APPROVALS
- DSN:
- CHK:
- REFERENCE DOCUMENTS
- BOM:
- FAB DWG:
- PCB DWG:
- ASSY DWG:
- Date:
- SIZE
- B
- Ver:
- FILE NAME
- DWG NO.
- SHEET
- OF
- REV

### Library data of the parts
C6 = Cap_4.7uF_10V_10%_0402: CAP CER 4.7UF 10V X5R 0402; Part Number: C1005X5R1A475K050BC; Manufacturer 1: TDK; Dielectric Material: Ceramic; Value: 4.7µF, 10V, X5R; Supplier 1: Mouser; Manufacturer Part Number 1: C1005X5R1A475K050BC; RoHS: Yes; Category: Ceramic Capacitors; Stock 1: 1272492; Mount: Surface Mount; Case/Package: 0402; Case Code (Metric): 1005; Case Code (Imperial): 0402; Min Operating Temperature: -55°C; Max Operating Temperature: 85°C; Package Quantity: 10000; Packaging: Cut Tape; Voltage Rating (DC): 10V; Series: C; Dielectric: X5R; Length: 0.039inch; Width: 0.02inch; Thickness: 0.022inch; Lead Free: Lead Free; RoHS Compliant: Yes; Reach SVHC Compliant: Yes; ComponentLink1URL: https://datasheet.ciiva.com/14895/tdkmlcccaprange-14895671.pdf?src-supplier=Digi-Key; ComponentLink1Description: https://datasheet.ciiva.com/14895/tdkmlcccaprange-14895671.pdf?src-supplier=Digi-Key; ComponentLink2URL: https://datasheet.ciiva.com/14895/tdkmlcccaprange-14895670.pdf?src-supplier=Digi-Key; ComponentLink2Description: https://datasheet.ciiva.com/14895/tdkmlcccaprange-14895670.pdf?src-supplier=Digi-Key; ComponentLink3URL: https://datasheet.ciiva.com/14895/tdkmlcccaprange-14895672.pdf?src-supplier=Digi-Key; ComponentLink3Description: https://datasheet.ciiva.com/14895/tdkmlcccaprange-14895672.pdf?src-supplier=Digi-Key; Supplier Part Number 1: 810-C1005X5R1A475KBC; Component Type: Generic; Capacitance: 4.7µF
C8 C9 = Cap_47nF_X7R_0201: 0201, 47nF, 10%, 25V, X7R; Value: 47nF, 0201 X7R; Mounting Type: SMT; Package: 0201; Applications: Automotive; Ratings: AEC-Q200; Component Type: Generic; Note: *; Supplier 1: Arrow Electronics; Supplier 2: Future Electronics; Supplier 3: Farnell; Supplier 4: Mouser; Supplier 5: Digikey; Supplier 6: Newark; Supplier Part Number 1: GRM033R61A473KE84D; Supplier Part Number 2: 4125905; Supplier Part Number 3: 3340765; Supplier Part Number 4: 81-GRM033R61A473KE4D; Supplier Part Number 5: 490-14570-1-ND; Supplier Part Number 6: 77AH4496
C24 = CMP-2000-05444-2: Chip Multilayer Ceramic Capacitors for General Purpose, 0603, 47uF, X5R, 15%, 20%, 6.3V; Voltage Rating (DC): 6.3V; Thickness: 0.039inch; Packaging: Tape and Reel; Width: 0.031inch; Dielectric: X5R; Max Operating Temperature: 85°C; Mount: Surface Mount; Case Code (Metric): 1608; Length: 0.063inch; Voltage Rating: 6.3V; Tolerance: 20%; Case/Package: 0603; Min Operating Temperature: -55°C
IC1 = MT29F8G08ADADAH4-IT_D: IC FLASH NAND 8GB 63VFBGA; Manufacturer_Name: Micron; Manufacturer_Part_Number: MT29F8G08ADADAH4-IT:D; Manufacturer: Micron Technology; Memory Format: FLASH,NAND,SLC NAND; Interface: Parallel; Memory Size: 1000000000B; Address Bus Width: 1b; Operating Supply Voltage: 3.3V; Min Supply Voltage: 2.7V; Max Supply Voltage: 3.6V; Word Size: 8b; Page Size: 2KB; Sync/Async: Asynchronous; Access Time-Max: 25ns; Supply Current: 35mA; Datasheet Link: https://www.mouser.co.uk/datasheet/2/671/micron_technology_micts06228-1-1759217.pdf; Height: 1mm; Mouser Part Number: 340-112428-TRAY; Mouser Price/Stock: https://www.mouser.co.uk/ProductDetail/Micron/MT29F8G08ADADAH4-ITD?qs=rrS6PyfT74eZPKUjEpJhBg%3D%3D; Arrow Part Number: MT29F8G08ADADAH4-IT:D; Arrow Price/Stock: https://www.arrow.com/en/products/mt29f8g08adadah4-itd/micron-technology; Supplier 1: Mouser; Supplier Part Number 1: 340-112428-TRAY; Manufacturer Part Number: MT29F8G08ADADAH4-IT:D; RoHS: Yes; Category: Flash; Stock 1: 2500; Pricing 1: 1=13.1, 10=12.13, 50=10.38, 100=9.87, 1000=9.77, 10000=9.77 (USD); Mounting Technology: Surface Mount; Case/Package: VFBGA; Pins: 63; Min Operating Temperature: -40°C; Max Operating Temperature: 85°C; Packaging: Bulk; Series: -; Package Quantity: 1000; Density: 8Gb; Radiation Hardening: No; Lead Free: Lead Free; RoHS Compliant: Yes; ComponentLink1URL: http://components.arrow.com/part/dataview/50637507S8848452N2596?src-supplier=Arrow+Electronics; ComponentLink1Description: http://components.arrow.com/part/dataview/50637507S8848452N2596?src-supplier=Arrow+Electronics; ComponentLink2URL: https://www.verical.com/server-webapp/html/getDatasheet?partID=338141&src-supplier=Verical; ComponentLink2Description: https://www.verical.com/server-webapp/html/getDatasheet?partID=338141&src-supplier=Verical
R7 R8 R11 R14-R16 R26 = Res_20k_1%_0402: 0402,20K,1%,63mW,50V; Part Number: RC0402FR-0720KL; Manufacturer 1: YAGEO; Temperature Coefficient: 100 PPM / C; Voltage: 50V; Tolerance: ±1%; Operating Temperature: -55°C ~ 125°C; Package: 0402 (1005 Metric); Component Type: Generic; Resistance: 20kOhm; Note: *; Alternative Part Number: *; Manufacturer 2: *; Manufacturer Part Number 2: *; Mounting Type: SMT; Manufacturer Part Number 1: RC0402FR-0720KL; Supplier 1: Digi-Key; Supplier 2: Mouser; Supplier 3: Farnell; Supplier Part Number 1: 311-20.0KLRCT-ND; Supplier Part Number 2: 603-RC0402FR-0720KL; Supplier Part Number 3: 3495551
  R7 R8 R14-R16 R26: Value: 20K,1%,63mW,50V
R13 R17-R22 = Res_4K7_1%_0402: as R5 on sheet ZYNQ_PS; Voltage: 50V; Tolerance: ±1%; Operating Temperature: -55°C ~ 125°C; Package: 0402 (1005 Metric); Component Type: Generic; Resistance: 4.7K; Note: *; Manufacturer 2: Bourns; Manufacturer Part Number 2: CR0402-FX-4701GLF; Mounting Type: SMT; Manufacturer Part Number 1: AC0402FR-074K7L; Supplier 1: Mouser; Supplier 2: Digi-Key; Supplier 3: Farnell; Supplier 4: Mouser; Supplier 5: Digi-Key; Supplier 6: Farnell; Supplier Part Number 1: 603-AC0402FR-074K7L; Supplier Part Number 2: YAG3497CT-ND; Supplier Part Number 3: 3495205; Supplier Part Number 4: 652-CR0402FX-4701GLF; Supplier Part Number 6: 4014423; Supplier Part Number 5: CR0402-FX-4701GLFCT-ND
R23 = Res_4K7_1%_0402: 0402,4.7K,1%,63mW,50V; Part Number: AC0402FR-074K7L; Manufacturer 1: YAGEO; Alternative Part Number: CR0402-FX-4701GLF; Temperature Coefficient: 100 PPM / C; Voltage: 50V; Tolerance: ±1%; Operating Temperature: -55°C ~ 125°C; Package: 0402 (1005 Metric); Component Type: Generic; Resistance: 4.7K; Note: *; Manufacturer 2: Bourns; Manufacturer Part Number 2: CR0402-FX-4701GLF; Mounting Type: SMT; Manufacturer Part Number 1: AC0402FR-074K7L; Supplier 1: Mouser; Supplier 2: Digi-Key; Supplier 3: Farnell; Supplier 4: Mouser; Supplier 5: Digi-Key; Supplier 6: Farnell; Supplier Part Number 1: 603-AC0402FR-074K7L; Supplier Part Number 2: YAG3497CT-ND; Supplier Part Number 3: 3495205; Supplier Part Number 4: 652-CR0402FX-4701GLF; Supplier Part Number 6: 4014423; Supplier Part Number 5: CR0402-FX-4701GLFCT-ND
R24 R25 = Res_0R_0402: 0402, 0R; Part Number: CRCW04020000Z0EDC; Manufacturer 1: Vishay; Voltage: 50V; Temperature Coefficient: 0 PPM / C; Operating Temperature: -55°C ~ 125°C; Mounting Type: SMT; Package: 0402 (1005 Metric); Applications: Commercial Grade; Supplier 1: Mouser; Supplier Part Number 1: 71-CRCW04020000Z0EDC; Manufacturer Part Number 1: CRCW04020000Z0EDC; Component Type: Generic; Resistance: 0 Ohms; Note: *; Supplier 2: DigiKey; Supplier 3: Farnell; Supplier Part Number 2: 541-4062-1-ND; Supplier Part Number 3: *